# Altium project Design 1 - Telemetry Module.PrjPcb (part 2 of 2)
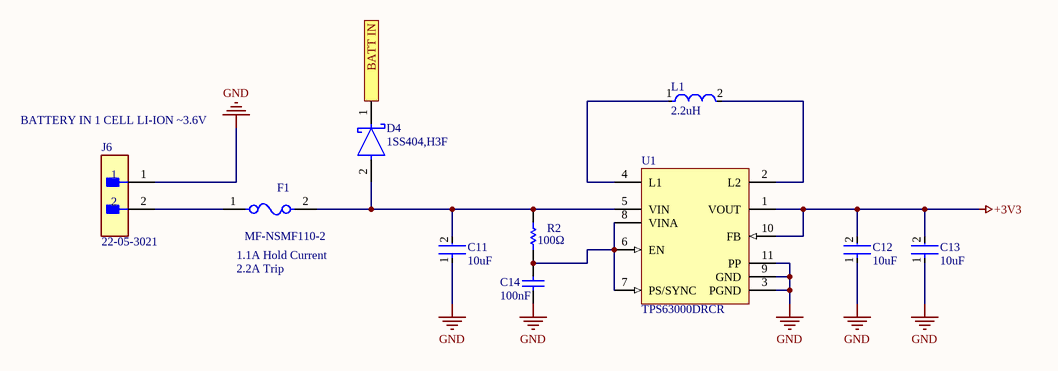
[diagram p7: Power.SchDoc]

## Nets that join several sheets
+3V3: Flight_Computer (11 pins), SD_Card (5 pins), Radio (C22.2 IC6.10), Sensors (14 pins), IO (5 pins), Power (C12.2 C13.2 U1.1 U1.10)
GND: Flight_Computer (12 pins), SD_Card (9 pins), Radio (14 pins), Sensors (27 pins), IO (18 pins), Power (8 pins)
CLK: Flight_Computer (IC2.80), SD_Card (IC1.3)
CMD: Flight_Computer (IC2.83), SD_Card (IC1.6)
D2_N: Flight_Computer (IC2.70), IO (D2.1)
D2_P: Flight_Computer (IC2.71), IO (D2.3)
DAT0: Flight_Computer (IC2.65), SD_Card (IC1.2)
DAT1: Flight_Computer (IC2.66), SD_Card (IC1.1)
DAT2: Flight_Computer (IC2.78), SD_Card (IC1.8)
DAT3: Flight_Computer (IC2.79), SD_Card (IC1.7)
NetC3_2: Flight_Computer (IC2.14), IO (5 pins)
NetC24_2: Flight_Computer (IC2.84), Sensors (C24.2 IC4.2)
NetC25_2: Flight_Computer (IC2.39), Sensors (C25.2 J8.2)
NetC26_2: Flight_Computer (IC2.36), Sensors (C26.2 J9.2)
NetC27_2: Flight_Computer (IC2.38), Sensors (C27.2 J10.2)
NetC28_2: Flight_Computer (IC2.37), Sensors (C28.2 J11.2)
NetD3_2: Flight_Computer (IC2.95), IO (D3.2)
NetD3_5: Flight_Computer (IC2.96), IO (D3.5)
NetD3_6: Flight_Computer (IC2.97), IO (D3.6)
NetD4_1: Flight_Computer (R12.2), Power (D4.1)
NetIC2_33: Flight_Computer (IC2.33), Sensors (IC3.4 IC3.5)
NetIC2_47: Flight_Computer (IC2.47), Sensors (IC5.20)
NetIC2_48: Flight_Computer (IC2.48), Sensors (IC5.19)
NetIC2_51: Flight_Computer (IC2.51), Sensors (IC5.14)
NetIC2_54: Flight_Computer (IC2.54), IO (Q1.1 R6.2)
NetIC2_57: Flight_Computer (IC2.57), IO (R16.1)
NetIC2_58: Flight_Computer (IC2.58), IO (R15.1)
NetIC2_59: Flight_Computer (IC2.59), IO (R14.1)
NetIC2_64: Flight_Computer (IC2.64), SD_Card (R1.1 SD1.9)
NetIC2_72: Flight_Computer (IC2.72), IO (SWD1.2)
NetIC2_76: Flight_Computer (IC2.76), IO (SWD1.4)
NetIC2_89: Flight_Computer (IC2.89), Radio (IC6.25)
NetIC2_90: Flight_Computer (IC2.90), Radio (IC6.26)
NetIC2_91: Flight_Computer (IC2.91), Radio (IC6.27)
NetIC2_92: Flight_Computer (IC2.92), Radio (IC6.28)
Rx: Flight_Computer (IC2.24), IO (J4.2)
SCK: Flight_Computer (IC2.30), Sensors (IC3.8)
SDI: Flight_Computer (IC2.31), Sensors (IC3.7)
SDO: Flight_Computer (IC2.32), Sensors (IC3.6)
Tx: Flight_Computer (IC2.23), IO (J4.3)
WAKE: Flight_Computer (IC2.7), IO (J4.4)